# Altium schematic sheet 4-LuxSensor.SCHDOC
size A4
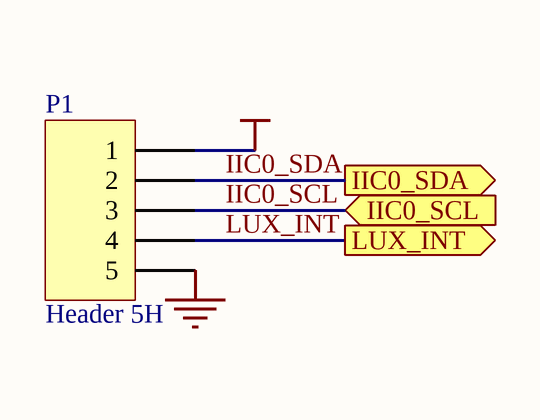
[diagram p0: 4-LuxSensor.SCHDOC]

## Parts
P1  Header 5H  [XH-05H]

## Ports
IIC0_SCL (in), IIC0_SDA (out), LUX_INT (out)

## Nets
GND: P1.5
VCC_2V8: P1.1
IIC0_SCL: P1.3 ; port IIC0_SCL
IIC0_SDA: P1.2 ; port IIC0_SDA
LUX_INT: P1.4 ; port LUX_INT

## Library data of the parts
P1 = Header 5H: Header, 5-Pin, Right Angle; LatestRevisionDate: 17-Jul-2002; LatestRevisionNote: Re-released for DXP Platform.; Publisher: Altium Limited